# EAGLE design stepstick_single (EAGLE 6.4)
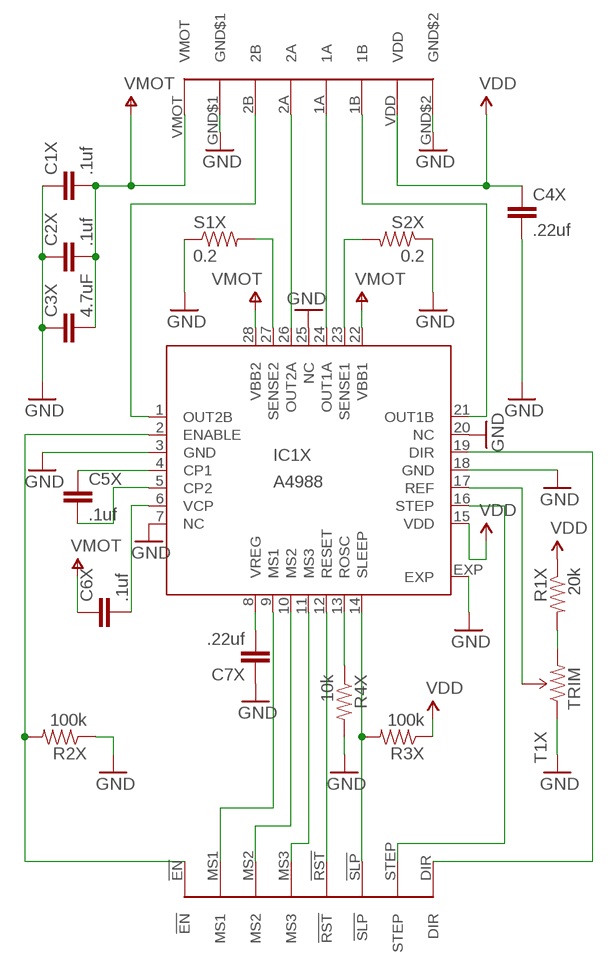
[diagram p0: schematic, sheet 1]

## Parts
C1X  .1uf  CAP0402-CAP  [0402-CAP]
C2X  .1uf  CAP0402-CAP  [0402-CAP]
C3X  4.7uF  CAP1206  [1206]
C4X  .22uf  CAP0402-CAP  [0402-CAP]
C5X  .1uf  CAP0402-CAP  [0402-CAP]
C6X  .1uf  CAP0402-CAP  [0402-CAP]
C7X  .22uf  CAP0402-CAP  [0402-CAP]
IC1X  A4988  A4983  [QFN28ET]
J1X  CLONOLU  [CLONOLU]
R1X  20k  RESISTOR0402-RES  [0402-RES]
R2X  100k  RESISTOR0402-RES  [0402-RES]
R3X  100k  RESISTOR0402-RES  [0402-RES]
R4X  10k  RESISTOR0402-RES  [0402-RES]
S1X  0.2  RESISTOR  [0805]
S2X  0.2  RESISTOR  [0805]
T1X  TRIM  TRIMPOTSMD  [TRIMPOT-3MM]

## Nets
GND: C1X.1 C2X.1 C3X.1 C4X.2 C7X.1 IC1X.3(GND) IC1X.7(NC) IC1X.18(GND) IC1X.20(NC) IC1X.25(NC) IC1X.EXP J1X.GND$1(A4983$2:GND$1) J1X.GND$2(A4983$2:GND$2) R2X.1 R4X.2 S1X.1 S2X.1 T1X.1(CCW)
VDD: C4X.1 IC1X.15(VDD) J1X.VDD(A4983$2:VDD) R1X.1 R3X.1
VMOT: C1X.2 C2X.2 C3X.2 C6X.1 IC1X.22(VBB1) IC1X.28(VBB2) J1X.VMOT(A4983$2:VMOT)
XCP1: C5X.1 IC1X.4(CP1)
XCP2: C5X.2 IC1X.5(CP2)
XDIR: IC1X.19(DIR) J1X.DIR(A4983$1:DIR)
XENABLE: IC1X.2(ENABLE) J1X.!EN(A4983$1:!EN) R2X.2
XMS1: IC1X.9(MS1) J1X.MS1(A4983$1:MS1)
XMS2: IC1X.10(MS2) J1X.MS2(A4983$1:MS2)
XMS3: IC1X.11(MS3) J1X.MS3(A4983$1:MS3)
XOUT1A: IC1X.24(OUT1A) J1X.1A(A4983$2:1A)
XOUT1B: IC1X.21(OUT1B) J1X.1B(A4983$2:1B)
XOUT2A: IC1X.26(OUT2A) J1X.2A(A4983$2:2A)
XOUT2B: IC1X.1(OUT2B) J1X.2B(A4983$2:2B)
XREF: IC1X.17(REF) T1X.2(WIPER)
XREF2: R1X.2 T1X.3(CW)
XRESET: IC1X.12(RESET) J1X.!RST(A4983$1:!RST)
XROSC: IC1X.13(ROSC) R4X.1
XSENSE1: IC1X.23(SENSE1) S2X.2
XSENSE2: IC1X.27(SENSE2) S1X.2
XSLEEP: IC1X.14(SLEEP) J1X.!SLP(A4983$1:!SLP) R3X.2
XSTEP: IC1X.16(STEP) J1X.STEP(A4983$1:STEP)
XVCP: C6X.2 IC1X.6(VCP)
XVREG: C7X.2 IC1X.8(VREG)

## Library data of the parts
C1X C2X C3X C4X C5X C6X C7X = SparkFun:CAP: Capacitor Standard 0603 ceramic capacitor, and 0.1" leaded capacitor.
IC1X = allegro:A4983: DMOS Microstepping Driver with Translator Auto generated by make-symbol-device-package-bsdl.ulp Rev. 32 Source: http://www.allegromicro.com/en/Products/Part_Numbers/4983/4983.pdf; MPN: A4983SETTR-T; OC_FARNELL: 1688956; OC_NEWARK: 39M6763
J1X = pololu-allegro:CLONOLU
R1X R2X R3X R4X S1X S2X = SparkFun:RESISTOR: Resistor Basic schematic elements and footprints for 0603, 1206, and PTH 1/10th watt (small) resistors.
T1X = SparkFun:TRIMPOT

## Board
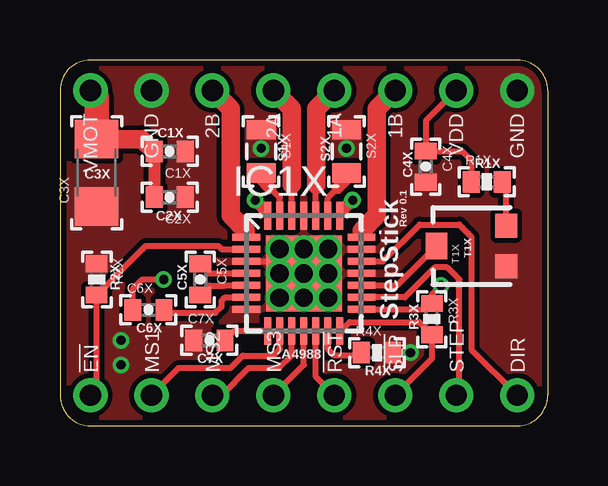
[diagram p1: board, top side]
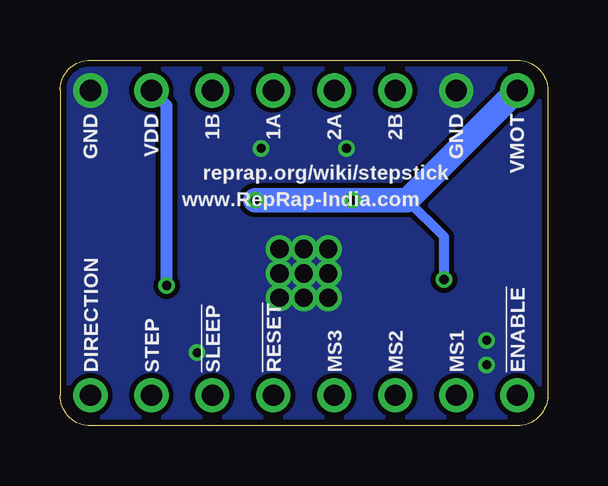
[diagram p2: board, bottom side, seen from below]

Size 20.32 x 15.24 mm. Coordinates in mm from the lower left corner, seen from the top.
Outline: 0,13.97 arc-90 1.27,15.24 19.05,15.24 arc-90 20.32,13.97 20.32,1.27 arc-90 19.05,0 1.27,0 arc-90 0,1.27
Outline: 0,13.97 0,1.27
Outline: 0,13.97 0,1.27
Copper layers (1*16): Top 0.035mm / dielectric 1.5mm / Bottom 0.035mm
Design rules "ITead_rule *": minimum track width 8mil, minimum drill 12mil, track to track 8mil, track to pad 8mil, pad to pad 7mil, via to via 8mil, smd to smd 0mil, copper to edge 10mil, drill to drill 10mil, minimum pad ring 10mil, minimum via ring 6mil, stop-mask expansion 2mil, vias tented up to drill 100mil, thermal gap 10mil

### Footprints (pad centres in the part's own frame; a part is rotated, then mirrored left to right if it is on the bottom)
0402-CAP = smd 0.7 x 0.9: 1 -0.65,0; 2 0.65,0
1206 = smd 1.6 x 1.8: 1 -1.4,0; 2 1.4,0
QFN28ET = smd 1.15 x 0.3: 1 -2.4,1.5; 2 -2.4,1; 3 -2.4,0.5; 4 -2.4,0; 5 -2.4,-0.5; 6 -2.4,-1; 7 -2.4,-1.5; 15 2.4,-1.5; 16 2.4,-1; 17 2.4,-0.5; 18 2.4,0; 19 2.4,0.5; 20 2.4,1; 21 2.4,1.5 | smd 0.3 x 1.15: 8 -1.5,-2.4; 9 -1,-2.4; 10 -0.5,-2.4; 11 0,-2.4; 12 0.5,-2.4; 13 1,-2.4; 14 1.5,-2.4; 22 1.5,2.4; 23 1,2.4; 24 0.5,2.4; 25 0,2.4; 26 -0.5,2.4; 27 -1,2.4; 28 -1.5,2.4 | smd 3.15 x 3.15: EXP 0,0
CLONOLU = drill 0.889 pad 1.422: 1A 6.35,-1.27; 1B 6.35,-3.81; 2A 6.35,1.27; 2B 6.35,3.81; !EN -6.35,8.89; !RST -6.35,-1.27; !SLP -6.35,-3.81; DIR -6.35,-8.89; GND$1 6.35,6.35; GND$2 6.35,-8.89; MS1 -6.35,6.35; MS2 -6.35,3.81; MS3 -6.35,1.27; STEP -6.35,-6.35; VDD 6.35,-6.35; VMOT 6.35,8.89
0402-RES = smd 0.7 x 0.9: 1 -0.65,0; 2 0.65,0
0805 = smd 0.8 x 1.2: 1 -0.9,0; 2 0.9,0
TRIMPOT-3MM = smd 1 x 0.9: 1 -0.85,-1.45; 3 0.85,-1.45 | smd 1.1 x 0.9: 2 0,1.45

### Placement (x,y rotation side)
C1X  4.57,11.43 180 top
C2X  4.57,9.53 180 top
C3X  1.52,10.54 90 top
C4X  15.24,10.79 270 top
C5X  5.84,6.1 270 top
C6X  3.68,4.83 0 top
C7X  6.22,3.56 0 top
IC1X  10.16,6.35 0 top
J1X  10.16,7.62 90 top
R1X  17.78,10.16 0 top
R2X  1.52,6.1 270 top
R3X  15.49,4.45 270 top
R4X  13.21,3.05 0 top
S1X  8.38,11.43 270 top
S2X  11.94,11.43 270 top
T1X  17.14,7.49 90 top

### Tracks (layer width: path | path; a pad name or v marks a point on that pad's centre or on a via)
GND  (via drill 0.38, 0.76)
  Top 0.254: IC1X.3 8.64,6.85 arc-90 v9.14,6.35
  other vias: 8.38,11.56 11.94,11.56 10.16,7.37 9.14,7.37 11.18,7.37 11.18,5.33 9.14,5.33 10.16,6.35 11.18,6.35 10.16,5.33 14.61,3.05 2.54,2.54 2.54,3.56
  pour Top (rank 6, no thermals): 0,15.24 20.07,15.24 20.07,0 0,0
  pour Bottom (rank 6, no thermals): 0,15.24 20.07,15.24 20.07,0 0,0
VDD  (via drill 0.38)
  Top 0.254: IC1X.15 15.25,4.85 R3X.1 15.49,5.46 v15.88,5.84 | R1X.1 17.13,11.06 16.76,11.43 15.26,11.43 C4X.1 15.24,12.7 J1X.VDD
  Bottom 0.508: v15.88,5.84 15.88,13.34 J1X.VDD
VMOT  (via drill 0.38)
  Top 0.254: 8.51,9.02 8.65,8.76 IC1X.28 | 11.81,9.02 11.67,8.76 IC1X.22 | C6X.1 3.03,5.7 3.43,6.1 v4.32,6.1
  Top 0.508: v8.13,9.4 8.51,9.02 | v12.19,9.4 11.81,9.02 | C1X.2 C2X.2 3.94,9.51
  Top 0.762: C1X.2 3.41,11.94 C3X.2
  Top 1.016: C3X.2 1.52,13.72 J1X.VMOT
  Bottom 0.406: v4.32,6.1 4.32,7.87 5.84,9.4
  Bottom 1.016: v12.19,9.4 v8.13,9.4 5.84,9.4 J1X.VMOT
XCP1
  Top 0.254: IC1X.4 6.24,6.35 C5X.1
XCP2
  Top 0.254: IC1X.5 6.87,5.85 6.86,5.84 6.24,5.84 C5X.2
XDIR
  Top 0.254: IC1X.19 13.45,6.85 14.99,8.38 16.64,8.38 16.76,8.26 17.02,8 17.14,7.87 17.14,3.17 J1X.DIR
XENABLE
  Top 0.254: J1X.!EN 1.52,1.52 R2X.2 3.43,7.35 3.57,7.49 6.6,7.49 6.75,7.35 IC1X.2
XMS1
  Top 0.254: IC1X.9 9.16,3.19 8.89,2.92 7.62,2.92 7.11,2.41 4.95,2.41 J1X.MS1
XMS2
  Top 0.254: J1X.MS2 6.73,1.27 7.87,2.41 9.14,2.41 9.65,2.92 9.66,2.93 IC1X.10
XMS3
  Top 0.254: J1X.MS3 10.16,2.54 IC1X.11
XOUT1A
  Top 0.254: IC1X.24 10.66,9.9 10.67,10.03
  Top 0.762: J1X.1A 10.67,13.21 10.67,10.03
XOUT1B
  Top 0.254: 12.57,8.13 12.57,7.86 IC1X.21
  Top 0.762: J1X.1B 13.21,13.21 13.21,8.76 12.57,8.13
XOUT2A
  Top 0.254: IC1X.26 9.66,9.9 9.65,10.03
  Top 0.762: J1X.2A 9.65,13.21 9.65,10.03
XOUT2B
  Top 0.254: 7.75,8.13 7.75,7.86 IC1X.1
  Top 0.762: J1X.2B 7.11,13.21 7.11,8.76 7.75,8.13
XREF
  Top 0.254: IC1X.17 14.05,5.85 T1X.2
XREF2
  Top 0.254: T1X.3 18.59,9.99 R1X.2
XRESET
  Top 0.254: J1X.!RST 10.66,2.04 IC1X.12
XROSC
  Top 0.254: IC1X.13 11.16,3.19 11.43,2.92 12.43,2.92 R4X.1
XSENSE1
  Top 0.254: IC1X.23 11.16,9.51 11.56,9.91
  Top 0.508: 11.56,9.91 11.94,10.29 S2X.2
XSENSE2
  Top 0.254: IC1X.27 9.16,9.51 8.76,9.91
  Top 0.508: 8.76,9.91 8.38,10.29 S1X.2
XSLEEP
  Top 0.254: J1X.!SLP 14.99,2.29 15.49,2.79 R3X.2 14.97,4.32 12.06,4.32 11.7,3.95 IC1X.14
XSTEP
  Top 0.254: IC1X.16 14.37,5.35 15.49,6.48 15.62,6.6 16.13,6.6 16.64,6.1 16.64,5.97 16.64,1.4 J1X.STEP
XVCP
  Top 0.254: IC1X.6 6.87,5.35 6.73,5.21 6.73,4.95 6.48,4.7 4.46,4.7 C6X.2
XVREG
  Top 0.254: IC1X.8 7.27,3.95 C7X.2

### Text on the board
_tsilk: C1X | S1X | S2X | C4X | R1X | C3X | Rev 0.1 | C2X | R2X | C5X | T1X | R3X | C6X | StepStick | C7X | A4988 | R4X
_bsilk: VMOT | GND | 2B | 2A | 1A | 1B | VDD | GND | reprap.org/wiki/stepstick | www.RepRap-India.com | !ENABLE | MS1 | MS2 | MS3 | !RESET | !SLEEP | STEP | DIRECTION